# Altium schematic sheet Power.SchDoc
size A4; DocumentNumber: 2; SheetNumber: 2; SheetTotal: 4
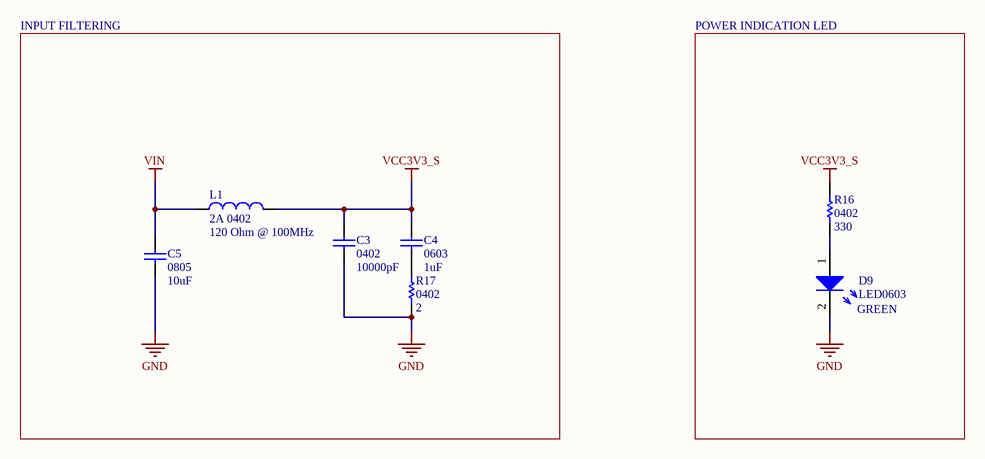
[diagram p0: Power.SchDoc]

## Parts
C3  0402  value 10000pF  [CAP0402R]
C4  0603  value 1uF  [CAP0603R]
C5  0805  value 10uF  [CAP0805R]
D9  LED0603  Colour: GREEN  [LED0603]
L1  2A 0402  value 120 Ohm @ 100MHz  [RES0402R]
R16  0402  value 330  [RES0402R]
R17  0402  value 2  [RES0402R]

## Blocks framed on the sheet
INPUT FILTERING: C3-C5 L1 R17
POWER INDICATION LED: D9 R16

## Nets
GND: C3.1 C5.1 D9.2 R17.1
VCC3V3_S: C3.2 C4.2 L1.2 R16.2
VIN: C5.2 L1.1
NetC4_1: C4.1 R17.2
NetD9_1: D9.1 R16.1

## Library data of the parts
C3 = CAP0402: 0402 capacitor; Manufacturer: Murata; Manufacturer Part Number: GCM155R71H103KA55D; Capacitance: 10nF; Tolerance: 10%; Voltage Rating: 50V; Dielectric: X7R; Supplier 1: Digi-Key; Supplier Part Number 1: 490-4762-1-ND; Stock 1: 23977554; Pricing 1: 1=0.1, 10=0.042, 100=0.0188, 500=0.01344, 1000=0.01056, 2500=0.0096, 5000=0.00883 (USD); Mount: Surface Mount; Case/Package: 0402; Case Code (Imperial): 0402; Case Code (Metric): 1005; Min Operating Temperature: -55°C; Max Operating Temperature: 125°C; Packaging: Tape and Reel; Package Quantity: 1; Termination: SMD/SMT; Voltage: 50V; Voltage Rating (DC): 50V; Length: 1mm; Height: 0.5mm; Width: 0.02inch; Thickness: 0.022inch; Depth: 0.5mm; Ratings: AEC-Q200; Radiation Hardening: No; REACH SVHC: No SVHC; Lead Free: Lead Free; ComponentLink1URL: http://psearch.murata.com/capacitor/product/GCM155R71H103KA55%23.pdf?src-supplier=Future+Electronics; ComponentLink1Description: http://psearch.murata.com/capacitor/product/GCM155R71H103KA55%23.pdf?src-supplier=Future+Electronics; ComponentLink2URL: https://www.verical.com/server-webapp/html/getDatasheet?partID=27433&src-supplier=Verical; ComponentLink2Description: https://www.verical.com/server-webapp/html/getDatasheet?partID=27433&src-supplier=Verical; ComponentLink3URL: http://psearch.en.murata.com/capacitor/product/GCM155R71H103KA55%23.pdf?src-supplier=Avnet; ComponentLink3Description: http://psearch.en.murata.com/capacitor/product/GCM155R71H103KA55%23.pdf?src-supplier=Avnet; ComponentLink4URL: http://psearch.murata.com/capacitor/product/GCM155R71H103KA55%23.pdf?src-supplier=Avnet+Europe; ComponentLink4Description: http://psearch.murata.com/capacitor/product/GCM155R71H103KA55%23.pdf?src-supplier=Avnet+Europe; ComponentLink5URL: http://search.murata.co.jp/Ceramy/image/img/A01X/partnumbering_e_02.pdf?src-supplier=Digi-Key; ComponentLink5Description: http://search.murata.co.jp/Ceramy/image/img/A01X/partnumbering_e_02.pdf?src-supplier=Digi-Key; ComponentLink6URL: http://uk.rs-online.com/webdocs/0ef9/0900766b80ef92d0.pdf?src-supplier=RSComponents; ComponentLink6Description: http://uk.rs-online.com/webdocs/0ef9/0900766b80ef92d0.pdf?src-supplier=RSComponents
C4 = CAP0603: 0603 capacitor; Manufacturer: KEMET; Manufacturer Part Number: C0603C105K4RACAUTO; Tolerance: 10%; Voltage Rating: 16V; Supplier 1: Digi-Key; Supplier Part Number 1: 399-17704-1-ND; Stock 1: 376276; Pricing 1: 1=0.17, 10=0.12, 100=0.0564, 500=0.03952, 1000=0.03273 (USD); Mount: Surface Mount; Case/Package: 0603; Case Code (Imperial): 0603; Case Code (Metric): 1608; Min Operating Temperature: -55°C; Max Operating Temperature: 125°C; Packaging: Cut Tape; Capacitance: 1uF; Ratings: AEC-Q200
C5 = CAP0805: 0805 capacitor; Manufacturer: Murata; Manufacturer Part Number: GCM21BR70J106KE22K; Tolerance: 10%; Dielectric: X7R; Voltage Rating (DC): 6.3V; Supplier 1: Digi-Key; Supplier Part Number 1: 490-14361-1-ND; Stock 1: 214938; Pricing 1: 1=0.42, 10=0.29, 100=0.1742, 500=0.13064, 1000=0.11031, 2500=0.10451, 5000=0.0987 (USD); Case/Package: 0805; Min Operating Temperature: -55°C; Max Operating Temperature: 125°C; Capacitance: 10uF; Packaging: Tape and Reel; Length: 2mm; Depth: 1.25mm; Lead Free: Lead Free
D9 = LED0603: Generic 0603 LED. Use ChipLED from Osram for generic ones.; Manufacturer: Osram Opto; Manufacturer Part Number: LTQ39G-Q1OO-25-1; Lens Style: Diffused,Colorless,Rectangular; Luminous Intensity: 280mcd; Forward Current: 15mA; Forward Voltage: 3.2V; Dominant Wavelength: 530nm; Luminous Flux: 0.55lm; Test Current: 5mA; Number of Elements: 1; Reverse Voltage: 5V; Supplier 1: Digi-Key; Supplier Part Number 1: 475-3442-1-ND; Stock 1: 27630; Pricing 1: 1=0.45, 10=0.327, 25=0.2668, 100=0.2134, 250=0.18004, 500=0.15336, 1000=0.12002 (USD); Mount: Surface Mount; Case/Package: SMD/SMT; Number of Pins: 2; Color: Green; Min Operating Temperature: -40°C; Max Operating Temperature: 85°C; Packaging: Tape and Reel; Number of LEDs: 1; Length: 1.7mm; Depth: 0.9mm; Radiation Hardening: No
L1 = Inductor: Manufacturer: Murata; Manufacturer Part Number: BLM15PX121SZ1D; Code_IEC: 1005; Number of Lines: 1; DC Resistance (DCR): 55mR; Published: 8-Jun-2000; LatestRevisionDate: 29-May-2009; LatestRevisionNote: IPC-7351 Footprint Added.; PackageReference: 0402-A; Publisher: Altium Limited; PackageDescription: Chip Inductor; Code_JEITA: 0402; Supplier 1: Digi-Key; Supplier Part Number 1: 490-16505-1-ND; Stock 1: 18936; Pricing 1: 1=0.15, 10=0.125, 25=0.0972, 50=0.0804, 100=0.0693, 250=0.05544, 500=0.0499, 1000=0.04158, 5000=0.03881 (USD); Mount: Surface Mount; Case/Package: 0402; Case Code (Imperial): 0402; Case Code (Metric): 1005; Min Operating Temperature: -55°C; Max Operating Temperature: 125°C; Packaging: Cut Tape; Max Current Rating: 2A; Ratings: AEC-Q200
R16 = RES0402: 0402 resistor; Manufacturer: TE Connectivity; Manufacturer Part Number: CRGCQ0402F330R; Resistance: 330R; Tolerance: 1%; Max Power Dissipation: 63mW; Temperature Coefficient: 100ppm/°C; Supplier 1: Digi-Key; Supplier Part Number 1: A129621CT-ND; Stock 1: 224275; Pricing 1: 1=0.1, 10=0.022, 100=0.009, 1000=0.00406, 2500=0.00352, 5000=0.00291 (USD); Case/Package: 0402; Case Code (Imperial): 0402; Case Code (Metric): 1005; Min Operating Temperature: -55°C; Max Operating Temperature: 155°C; Composition: Thick Film; Features: Moisture Resistant,Automotive AEC-Q200; Packaging: Tape and Reel; Number of Terminations: 2
R17 = RES0402: 0402 resistor; Manufacturer: Yageo; Manufacturer Part Number: AC0402FR-072RL; Resistance: 2R; Tolerance: 1%; Max Power Dissipation: 63mW; Temperature Coefficient: 200ppm/°C; Supplier 1: Digi-Key; Supplier Part Number 1: YAG3472CT-ND; Stock 1: 17701; Pricing 1: 1=0.1, 10=0.03, 100=0.012, 1000=0.0054, 2500=0.00468, 5000=0.00387 (USD); Case/Package: 0402; Case Code (Metric): 1005; Case Code (Imperial): 0402; Min Operating Temperature: -55°C; Max Operating Temperature: 155°C; Packaging: Tape and Reel; Composition: Thick Film; Number of Terminations: 2; Features: Moisture Resistant,Automotive AEC-Q200; Length: 0.039inch; Height: 0.015inch; Width: 0.02inch